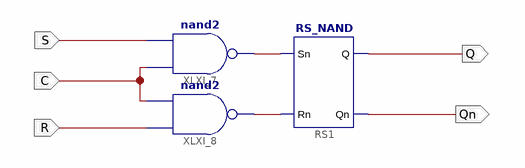
[diagram p0: schematic sheet 1]
// Xilinx ISE schematic RS_EN.sch (spartan3) as structural Verilog: 3 symbols, 5 ports
module RS_EN (
  input  S,
  input  C,
  input  R,
  output Q,
  output Qn
);

  wire XLXN_31, XLXN_32;

  nand XLXI_7 (XLXN_32, C, S);
  RS_NAND RS1 (.Qn(Qn), .Q(Q), .Sn(XLXN_32), .Rn(XLXN_31));
  nand XLXI_8 (XLXN_31, R, C);
endmodule
